# EAGLE design esp8266_y (EAGLE 9.6.2)
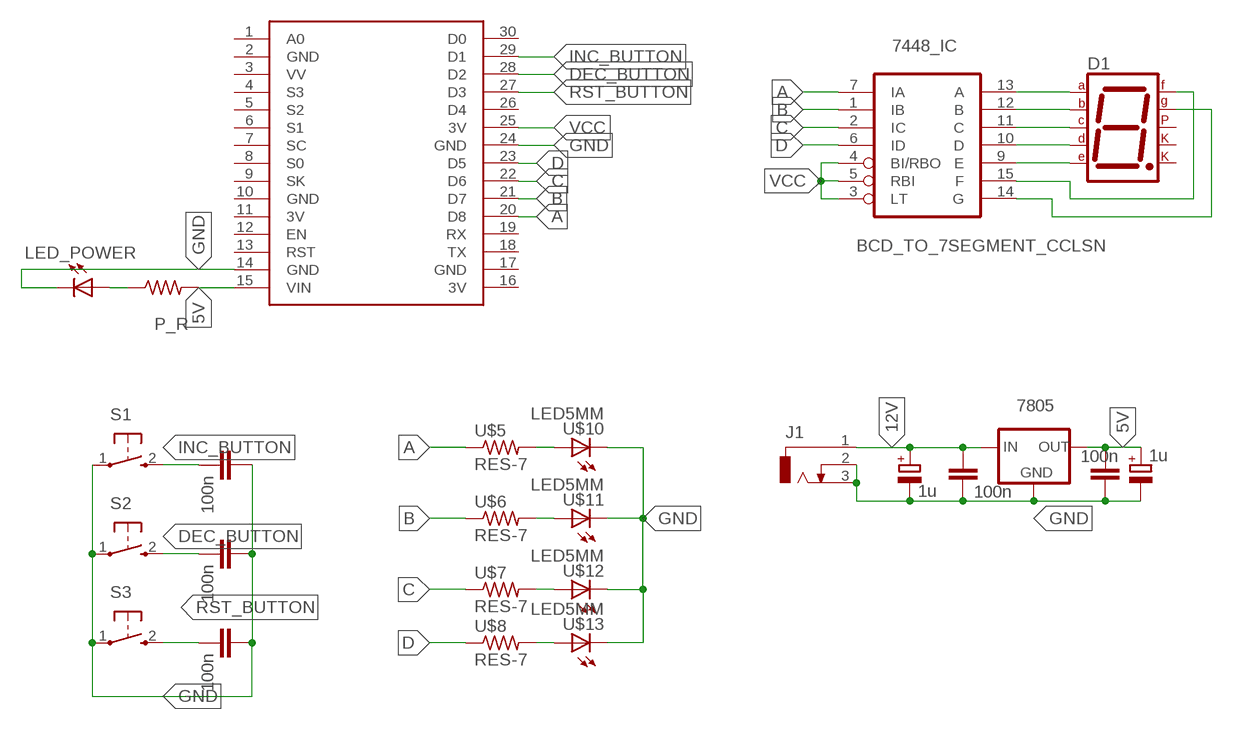
[diagram p0: schematic, sheet 1]

## Parts
7448_IC  BCD_TO_7SEGMENT_CCLSN  [DIL16]
7805  78XXS  [78XXS]
D1  7SEG-CK  [7SEG-13]
J1  CON_JACK  [DCJ0303]
LED_POWER  LED5MM  [LED5MM]
P_R  RES-7  [0204/7]
S1  PUSH_BUTTON  [B3F-10XX]
S2  PUSH_BUTTON  [B3F-10XX]
S3  PUSH_BUTTON  [B3F-10XX]
U$1  NODEMCU_V3  [NODEMCU]
U$2  100n  CAPACITOR  [C025-025X050]
U$3  100n  CAPACITOR  [C025-025X050]
U$4  100n  CAPACITOR  [C025-025X050]
U$5  RES-7  [0204/7]
U$6  RES-7  [0204/7]
U$7  RES-7  [0204/7]
U$8  RES-7  [0204/7]
U$10  LED5MM  [LED5MM]
U$11  LED5MM  [LED5MM]
U$12  LED5MM  [LED5MM]
U$13  LED5MM  [LED5MM]
U$15  1u  CAP_POL  [E3,5-8]
U$16  1u  CAP_POL  [E3,5-8]
U$17  100n  CAPACITOR  [C025-025X050]
U$18  100n  CAPACITOR  [C025-025X050]

## Nets
5V: 7805.OUT P_R.2 U$1.15(VIN) U$15.+ U$17.1
12V: 7805.IN J1.1 U$16.+ U$18.1
A: 7448_IC.7(IA) U$1.20(D8) U$5.1
B: 7448_IC.1(IB) U$1.21(D7) U$6.1
C: 7448_IC.2(IC) U$1.22(D6) U$7.1
D: 7448_IC.6(ID) U$1.23(D5) U$8.1
DEC_BUTTON: S2.2(S) U$1.28(D2) U$3.2
GND: 7805.GND J1.2 J1.3 LED_POWER.K(C) S1.1(P) S2.1(P) S3.1(P) U$1.14(GND) U$1.24(GND) U$2.1 U$3.1 U$4.1 U$10.K(C) U$11.K(C) U$12.K(C) U$13.K(C) U$15.- U$16.- U$17.2 U$18.2
INC_BUTTON: S1.2(S) U$1.29(D1) U$2.2
N$1: U$5.2 U$10.A
N$2: LED_POWER.A P_R.1
N$3: U$6.2 U$11.A
N$4: U$7.2 U$12.A
N$7: U$8.2 U$13.A
N$12: 7448_IC.11(C) D1.4(C)
N$13: 7448_IC.12(B) D1.6(B)
N$14: 7448_IC.13(A) D1.7(A)
N$15: 7448_IC.10(D) D1.2(D)
N$16: 7448_IC.9(E) D1.1(E)
N$17: 7448_IC.15(F) D1.9(F)
N$18: 7448_IC.14(G) D1.10(G)
RST_BUTTON: S3.2(S) U$1.27(D3) U$4.2
VCC: 7448_IC.3(LT) 7448_IC.4(BI/RBO) 7448_IC.5(RBI) U$1.25(3V)
Unconnected: D1.3(CK1) D1.5(DP) D1.8(CK2) U$1.1(A0) U$1.3(VV) U$1.4(S3) U$1.5(S2) U$1.6(S1) U$1.7(SC) U$1.8(S0) U$1.9(SK) U$1.12(EN) U$1.13(RST) U$1.18(TX) U$1.19(RX) U$1.26(D4) U$1.30(D0)

## Power pins joined to a net without a drawn wire
3V: U$1.11(3V) U$1.16(3V)
GND: 7448_IC.8(GND) U$1.2(GND) U$1.10(GND) U$1.17(GND)
VCC: 7448_IC.16(VCC)

## Library data of the parts
7448_IC = MIA_LIBRARY-2-2-2:BCD_TO_7SEGMENT_CC: BCD to seven segment DECODER/DRIVER
7805 = MIA_LIBRARY-2-2-2:78XXS: VOLTAGE REGULATOR
D1 = MIA_LIBRARY-2-2-2:7SEG-CK: 7-segment DISPLAY single cathode, 13 mm
J1 = MIA_LIBRARY-2-2-2:CON_JACK: DC POWER JACK Source: DCJ0303.pdf; OC_FARNELL: unknown; OC_NEWARK: unknown
LED_POWER U$10-U$13 = MIA_LIBRARY-2-2-2:LED5MM
P_R U$5-U$8 = MIA_LIBRARY-2-2-2:RES-7
S1-S3 = MIA_LIBRARY-2-2-2:PUSH_BUTTON: OMRON SWITCH
U$1 = MIA_LIBRARY-2-2-2:NODEMCU_V3
U$2-U$4 U$17 U$18 = MIA_LIBRARY-2-2-2:CAPACITOR
U$15 U$16 = MIA_LIBRARY-2-2-2:CAP_POL

## Board
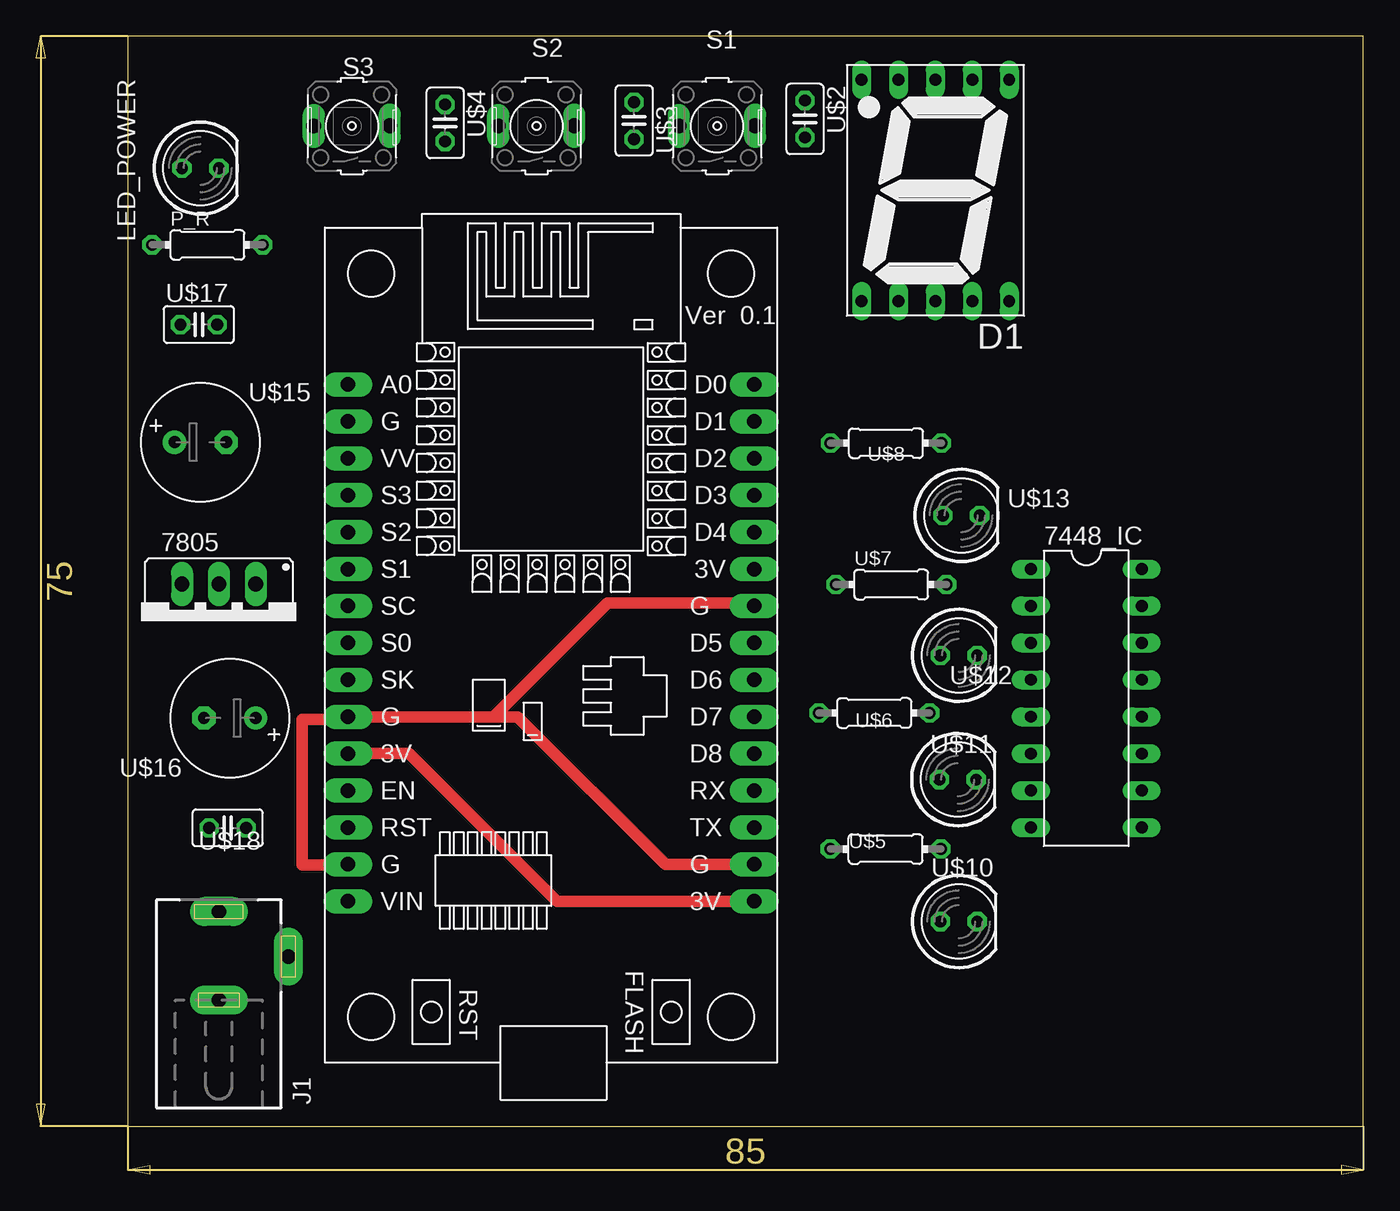
[diagram p1: board, top side]
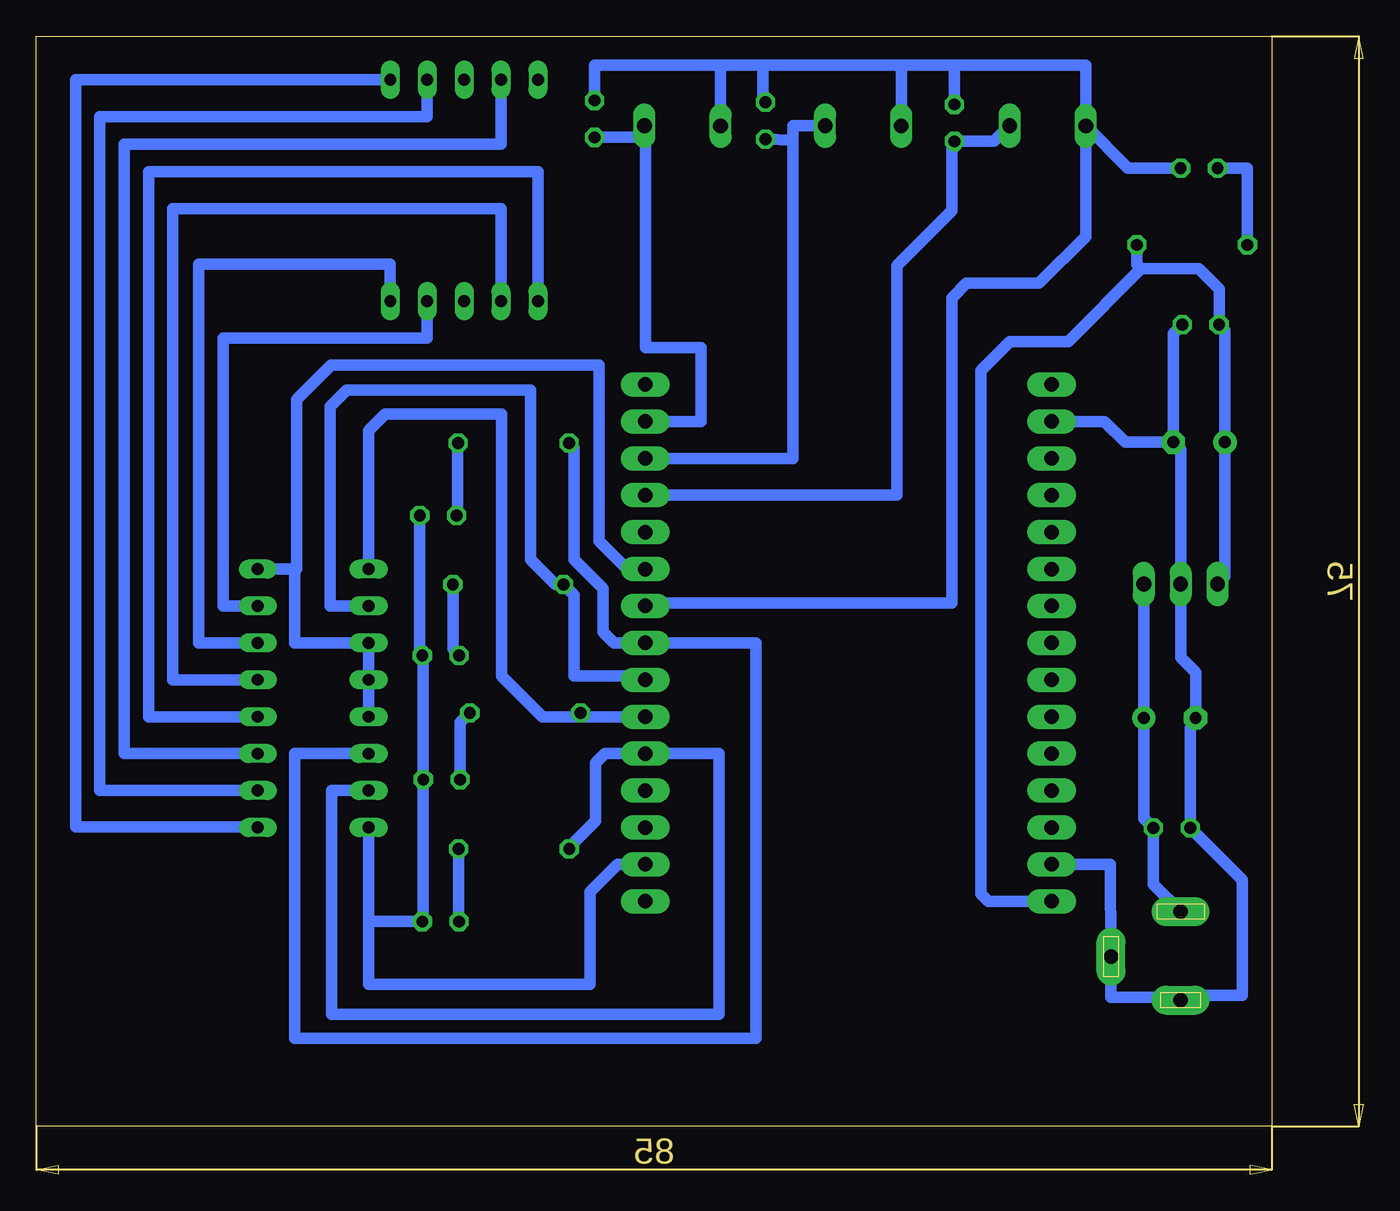
[diagram p2: board, bottom side, seen from below]

Size 85 x 75 mm. Coordinates in mm from the lower left corner, seen from the top.
Outline: 0,0 85,0 85,75 0,75 0,0
Copper layers (1*16): Top 0.035mm / dielectric 1.5mm / Bottom 0.035mm
Design rules "default *": minimum track width 0.6mm, minimum drill 0.35mm, track to track 0.8mm, track to pad 0.6mm, pad to pad 6mil, via to via 6mil, smd to smd 6mil, copper to edge 0.6mm, drill to drill 6mil, minimum pad ring 10mil, minimum via ring 8mil, stop-mask expansion 4mil, vias tented up to drill 0mil, thermal gap 10mil

### Footprints (pad centres in the part's own frame; a part is rotated, then mirrored left to right if it is on the bottom)
DIL16 = drill 0.813 long: 1 -8.89,-3.81; 2 -6.35,-3.81; 3 -3.81,-3.81; 4 -1.27,-3.81; 5 1.27,-3.81; 6 3.81,-3.81; 7 6.35,-3.81; 8 8.89,-3.81; 9 8.89,3.81; 10 6.35,3.81; 11 3.81,3.81; 12 1.27,3.81; 13 -1.27,3.81; 14 -3.81,3.81; 15 -6.35,3.81; 16 -8.89,3.81
78XXS = drill 1.016 long: GND 0,-2.54; IN -2.54,-2.54; OUT 2.54,-2.54
7SEG-13 = drill 0.813 long: 1 -5.08,-7.62; 2 -2.54,-7.62; 3 0,-7.62; 4 2.54,-7.62; 5 5.08,-7.62; 6 5.08,7.62; 7 2.54,7.62; 8 0,7.62; 9 -2.54,7.62; 10 -5.08,7.62
DCJ0303 = drill 1 pad 2 long: 1 0,3.1; 2 4.8,0; 3 0,-3
LED5MM = drill 0.813 octagon: A -1.27,0; K 1.27,0
0204/7 = drill 0.813 octagon: 1 -3.81,0; 2 3.81,0
B3F-10XX = drill 1.016 long: 1 0.013,2.636; 2 0.029,-2.605
NODEMCU = drill 1 pad 1.676 long: 1 -13.97,17.78; 2 -13.97,15.24; 3 -13.97,12.7; 4 -13.97,10.16; 5 -13.97,7.62; 6 -13.97,5.08; 7 -13.97,2.54; 8 -13.97,0; 9 -13.97,-2.54; 10 -13.97,-5.08; 11 -13.97,-7.62; 12 -13.97,-10.16; 13 -13.97,-12.7; 14 -13.97,-15.24; 15 -13.97,-17.78; 16 13.97,-17.78; 17 13.97,-15.24; 18 13.97,-12.7; 19 13.97,-10.16; 20 13.97,-7.62; 21 13.97,-5.08; 22 13.97,-2.54; 23 13.97,0; 24 13.97,2.54; 25 13.97,5.08; 26 13.97,7.62; 27 13.97,10.16; 28 13.97,12.7; 29 13.97,15.24; 30 13.97,17.78
C025-025X050 = drill 0.813 octagon: 1 -1.27,0; 2 1.27,0
E3,5-8 = drill 0.813 pad 1.6: + -1.778,0 | drill 0.813 pad 1.6 octagon: - 1.778,0

### Placement (x,y rotation side)
7448_IC  65.95,29.45 270 top
7805  6.26,34.77 180 top
D1  55.56,64.4 180 top
J1  6.26,11.67 0 top
LED_POWER  4.99,65.93 0 top
P_R  5.47,60.65 0 top
S1  40.55,68.82 90 top
S2  28.12,68.82 90 top
S3  15.42,68.82 90 top
U$1  29.12,33.26 0 top
U$2  46.59,69.31 270 top
U$3  34.83,69.2 270 top
U$4  21.83,69.04 270 top
U$5  52.14,19.07 0 top
U$6  51.36,28.44 0 top
U$7  52.53,37.28 0 top
U$8  52.16,47.01 0 top
U$10  57.17,14.08 0 top
U$11  57.1,23.85 0 top
U$12  57.17,32.4 0 top
U$13  57.34,42.03 0 top
U$15  4.99,47.07 0 top
U$16  7.01,28.09 180 top
U$17  4.88,55.17 0 top
U$18  6.86,20.53 180 top

### Tracks (layer width: path | path; a pad name or v marks a point on that pad's centre or on a via)
3V
  Top 0.8: U$1.16 29.52,15.48 19.36,25.64 U$1.11
5V
  Bottom 0.8: 7805.OUT 3.21,37.82 U$15.+ 3.21,54.77 U$17.1 3.61,57.61 5,59 9,59 | U$1.15 19.48,15.48 20,16 20,52 18,54 14,54 9,59 | P_R.2 9.28,59.28 9,59
12V
  Bottom 0.8: 7805.IN 8.8,27.8 8.79,27.79 U$16.+ 8.79,21.18 U$18.1 8.13,16.64 J1.1
A
  Bottom 0.8: 7448_IC.7 64.68,23.1 64.68,7.69 38.01,7.69 38.01,25.64 U$1.20 45.88,25.64 46.52,25 46.52,21 48.33,19.19 U$5.1
B
  Bottom 0.8: U$1.21 47.29,28.18 | 47.29,28.18 U$6.1 | 7448_IC.1 62.14,47.86 61,49 53,49 53,31 50.18,28.18 47.29,28.18
C
  Bottom 0.8: 7448_IC.2 64.79,35.8 64.79,49.51 63.63,50.66 51,50.66 51,39 49.28,37.28 U$7.1 48,36.56 48,31 43.37,31 U$1.22
D
  Bottom 0.8: 7448_IC.6 67.22,25.64 67.22,6.05 35.47,6.05 35.47,33.26 U$1.23 45.26,33.26 46,34 46,37 48,39 48,46.66 U$8.1
DEC_BUTTON
  Bottom 0.8: 30.66,68.85 S2.2 32.93,68.85 32.93,67.85 | 32.93,67.85 U$3.2 | 32.93,67.85 32.93,45.96 U$1.28
GND
  Top 0.8: 25.18,28.18 U$1.10 14.97,28 12,28 12,18 15.13,18 U$1.14 | 25.18,28.18 33,36 42.89,36 U$1.24 | 25.18,28.18 26.82,28.18 36.98,18.02 U$1.17
  Bottom 0.8: U$1.17 45,18.02 46.9,16.12 46.9,9.77 62.14,9.77 7448_IC.8 62.14,14.08 U$10.K 58.37,14.15 U$11.K 58.37,32.34 U$12.K 58.61,32.57 U$13.K | U$15.- 6.26,46.56 7805.GND 6.26,32.26 5.23,31.23 U$16.- 5.07,27.93 5.59,27.41 U$18.2 2,16.93 2,9 2.01,8.99 5.94,8.99 J1.3 6.45,8.86 11.06,8.86 J1.2 11.09,18.02 U$1.14 | U$15.- 6.77,54.55 U$17.2 | U$15.- 10.07,47.07 11.5,48.5 U$1.2 | U$1.24 42.89,36 22,36 22,57 21,58 16,58 12.78,61.22 S3.1 | S3.1 9.88,65.93 LED_POWER.K | U$2.1 46.59,73 37.91,73 | S1.1 37.91,73 | 37.91,73 35,73 | 35,73 25.48,73 | 25.48,73 S2.1 | U$3.1 35,70.47 35,73 | U$4.1 21.83,72 21.83,73 | S3.1 12.78,73 21.83,73 | 21.83,73 25.48,73
INC_BUTTON
  Bottom 0.8: U$1.29 39.28,48.5 39.28,53.58 43.09,53.58 43.09,68.85 S1.2 43.16,68.04 U$2.2
N$1
  Bottom 0.8: U$5.2 55.95,14.13 U$10.A
N$2
  Bottom 0.8: LED_POWER.A 1.66,65.93 P_R.1
N$3
  Bottom 0.8: U$11.A 55.83,27.78 U$6.2
N$4
  Bottom 0.8: U$7.2 56.34,32.84 U$12.A
N$7
  Bottom 0.8: U$8.2 56,46.98 56,42.1 U$13.A
N$12
  Bottom 0.8: D1.4 53.02,67.58 78.95,67.58 78.95,25.64 7448_IC.11
N$13
  Bottom 0.8: 7448_IC.12 77.28,28.18 77.28,65.67 50.48,65.67 D1.6
N$14
  Bottom 0.8: D1.7 53.02,63.13 75.61,63.13 75.61,30.72 7448_IC.13
N$15
  Bottom 0.8: 7448_IC.10 80.63,23.1 80.63,69.48 58.1,69.48 D1.2
N$16
  Bottom 0.8: D1.1 82.3,72.02 82.3,20.6 69.8,20.6 7448_IC.9
N$17
  Bottom 0.8: 7448_IC.15 72.15,35.8 72.15,54.24 58.1,54.24 D1.9
N$18
  Bottom 0.8: 7448_IC.14 73.82,33.26 73.82,59.32 60.64,59.32 D1.10
RST_BUTTON
  Bottom 0.8: U$1.27 25.77,43.42 25.77,59.23 22,63 22,67.77 U$4.2 19.1,67.77 S3.2
VCC
  Bottom 0.8: 7448_IC.4 7448_IC.5 7448_IC.3 67.22,33.26 67.22,38.34 7448_IC.16 67.09,38.34 67.09,50 64.71,52.38 46.27,52.38 46.27,40.27 44.34,38.34 U$1.25